# Altium project ESP32_Baseline_MCU.PrjPcb
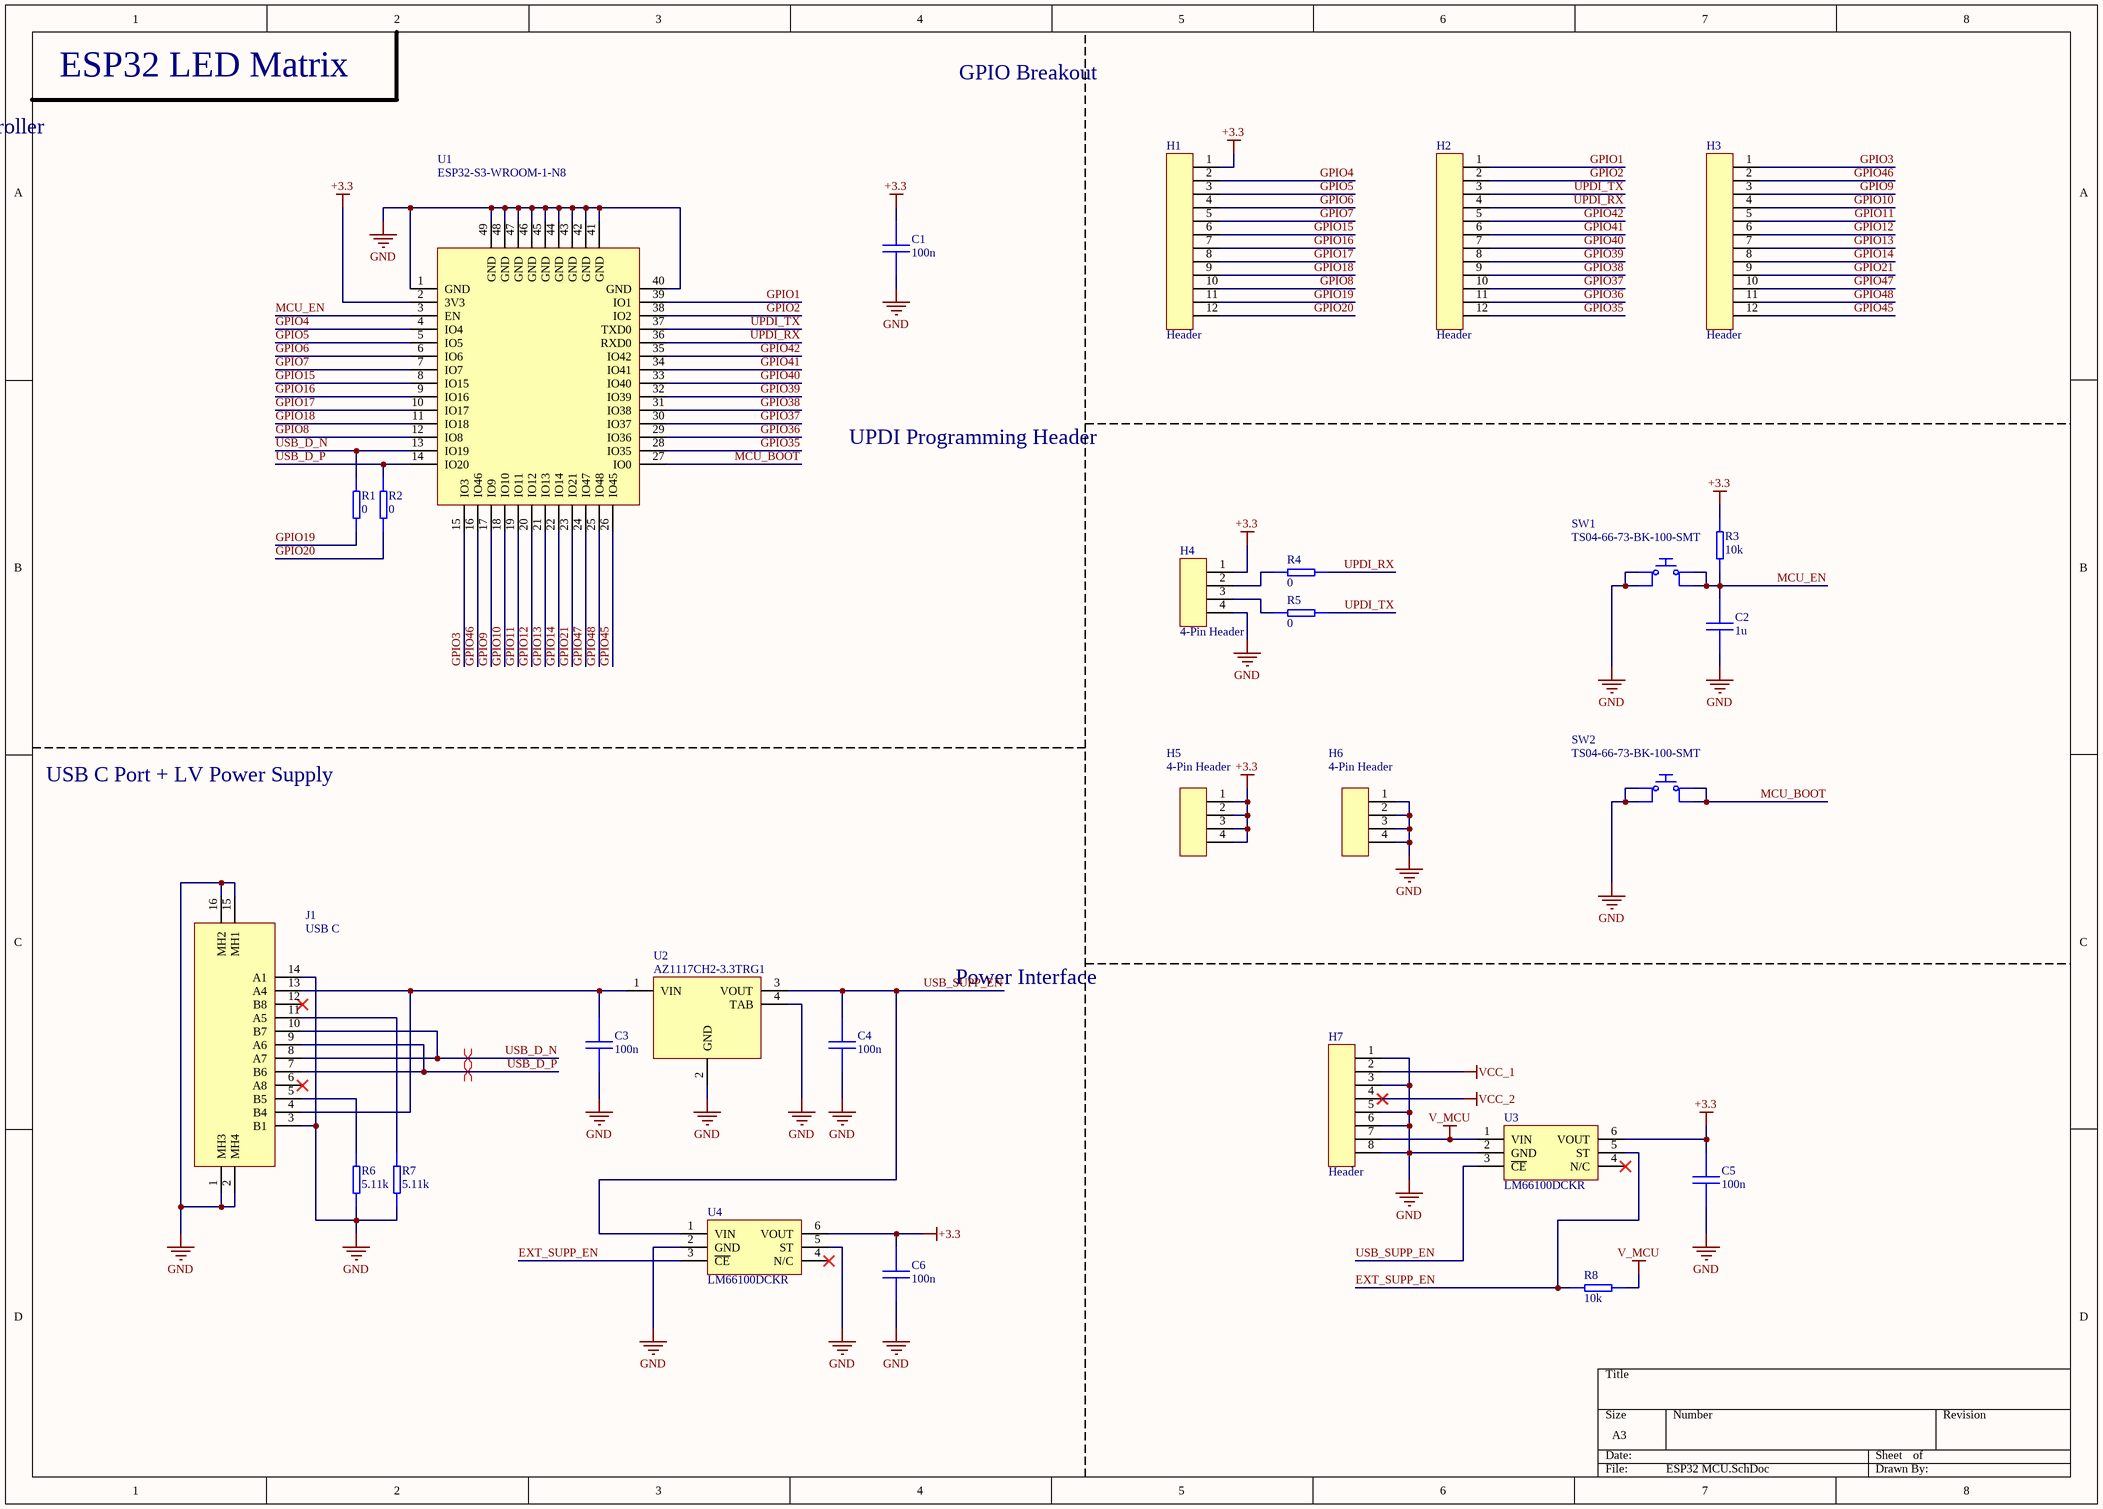
[diagram p0: ESP32 MCU.SchDoc]
1 sheet, 28 parts. Net scope: global (net labels, ports and power ports of the same name join across sheets).
Board file: ESP32_Baseline_MCU.PcbDoc

## Sheet ESP32 MCU.SchDoc
size A3; SheetNumber: 1; SheetTotal: 1

### Parts
C1  100n  [CAP0805]
C2  1u  [CAP0805]
C3  100n  [CAP0805]
C4  100n  [CAP0805]
C5  100n  [CAP0805]
C6  100n  [CAP0805]
H1  Header  [Header_1X12]
H2  Header  [Header_1X12]
H3  Header  [Header_1X12]
H4  4-Pin Header  [Header_1X4]
H5  4-Pin Header  [Header_1X4]
H6  4-Pin Header  [Header_1X4]
H7  Header  [Header_1X8]
J1  USB C  [USB TYPE C 12 PIN]
R1  0  [RESC0805]
R2  0  [RESC0805]
R3  10k  [RESC0805]
R4  0  [RESC0805]
R5  0  [RESC0805]
R6  5.11k  [RESC0805]
R7  5.11k  [RESC0805]
R8  10k  [RESC0805]
SW1  TS04-66-73-BK-100-SMT  [Tactile Button 6.0mm x 6.0mm]
SW2  TS04-66-73-BK-100-SMT  [Tactile Button 6.0mm x 6.0mm]
U1  ESP32-S3-WROOM-1-N8  [ESP32-S3-WROOM-1-N8]
U2  AZ1117CH2-3.3TRG1  [SOT223]
U3  LM66100DCKR  [SC70-6]
U4  LM66100DCKR  [SC70-6]

### Nets
+3.3: C1.1 C5.1 C6.1 H1.1 H4.1 H5.1 H5.2 H5.3 H5.4 R3.1 U1.2(3V3) U3.6(VOUT) U4.6(VOUT)
GND: C1.2 C2.2 C3.2 C4.2 C5.2 C6.2 H4.4 H6.1 H6.2 H6.3 H6.4 H7.1 H7.3 H7.5 H7.6 H7.8 J1.1(MH3) J1.2(MH4) J1.3(B1) J1.14(A1) J1.15(MH1) J1.16(MH2) R6.1 R7.1 SW1.1 SW1.2 SW2.1 SW2.2 U1.1(GND) U1.40(GND) U1.41(GND) U1.42(GND) U1.43(GND) U1.44(GND) U1.45(GND) U1.46(GND) U1.47(GND) U1.48(GND) U1.49(GND) U2.2(GND) U2.4(TAB) U3.2(GND) U4.2(GND) U4.5(ST)
V_MCU: H7.7 R8.2 U3.1(VIN)
VCC_1: H7.2
VCC_2: H7.4
EXT_SUPP_EN: R8.1 U3.5(ST) U4.3(~{CE})
GPIO1: H2.1 U1.39(IO1)
GPIO2: H2.2 U1.38(IO2)
GPIO3: H3.1 U1.15(IO3)
GPIO4: H1.2 U1.4(IO4)
GPIO5: H1.3 U1.5(IO5)
GPIO6: H1.4 U1.6(IO6)
GPIO7: H1.5 U1.7(IO7)
GPIO8: H1.10 U1.12(IO8)
GPIO9: H3.3 U1.17(IO9)
GPIO10: H3.4 U1.18(IO10)
GPIO11: H3.5 U1.19(IO11)
GPIO12: H3.6 U1.20(IO12)
GPIO13: H3.7 U1.21(IO13)
GPIO14: H3.8 U1.22(IO14)
GPIO15: H1.6 U1.8(IO15)
GPIO16: H1.7 U1.9(IO16)
GPIO17: H1.8 U1.10(IO17)
GPIO18: H1.9 U1.11(IO18)
GPIO19: H1.11 R1.1
GPIO20: H1.12 R2.1
GPIO21: H3.9 U1.23(IO21)
GPIO35: H2.12 U1.28(IO35)
GPIO36: H2.11 U1.29(IO36)
GPIO37: H2.10 U1.30(IO37)
GPIO38: H2.9 U1.31(IO38)
GPIO39: H2.8 U1.32(IO39)
GPIO40: H2.7 U1.33(IO40)
GPIO41: H2.6 U1.34(IO41)
GPIO42: H2.5 U1.35(IO42)
GPIO45: H3.12 U1.26(IO45)
GPIO46: H3.2 U1.16(IO46)
GPIO47: H3.10 U1.24(IO47)
GPIO48: H3.11 U1.25(IO48)
MCU_BOOT: SW2.3 SW2.4 U1.27(IO0)
MCU_EN: C2.1 R3.2 SW1.3 SW1.4 U1.3(EN)
UPDI_RX: H2.4 R4.1 U1.36(RXD0)
UPDI_TX: H2.3 R5.1 U1.37(TXD0)
USB_D_N: J1.8(A7) J1.10(B7) R1.2 U1.13(IO19)
USB_D_P: J1.7(B6) J1.9(A6) R2.2 U1.14(IO20)
USB_SUPP_EN: C4.1 U2.3(VOUT) U3.3(~{CE}) U4.1(VIN)
NetC3_1: C3.1 J1.4(B4) J1.13(A4) U2.1(VIN)
NetH4_2: H4.2 R4.2
NetH4_3: H4.3 R5.2
NetJ1_5: J1.5(B5) R6.2
NetJ1_11: J1.11(A5) R7.2

Not connected (* = marked no-connect by the designer): J1 6(A8)* 12(B8)*; U3 4(N/C)*; U4 4(N/C)*

### Layout directives
differential pair: USB_D_N, USB_D_P

### Notes on the sheet
- ESP32 LED Matrix
- GPIO Breakout
- Microcontroller
- UPDI Programming Header
- USB C Port + LV Power Supply
- Power Interface

### Library data of the parts
C1-C6 = Capacitor - Non Polarized: Non Polarized Capacitor
H1-H3 = 12-Pin Header
H7 = 8-Pin Header: System: Connector
J1 = USB Type C Connector 12 Pin
R1-R8 = Resistor
SW1 SW2 = TS04-66-73-BK-100-SMT: Switch; Manufacturer_Name: Same Sky; Datasheet Link: https://www.sameskydevices.com/product/resource/supplyframepdf/ts04.pdf; Height: 7.6mm; Manufacturer_Part_Number: TS04-66-73-BK-100-SMT; Mouser Part Number: 179-TS046673BK100SMT; Mouser Price/Stock: https://www.mouser.co.uk/ProductDetail/Same-Sky/TS04-66-73-BK-100-SMT?qs=A6eO%252BMLsxmRAmp3wqRUzZw%3D%3D; Arrow Part Number: TS04-66-73-BK-100-SMT; Arrow Price/Stock: https://www.arrow.com/en/products/ts04-66-73-bk-100-smt/cui-devices?utm_currency=USD&region=nac
U1 = ESP32-S3-WROOM-1-N8: ESP32 Microcontroller with Bluetooth and Wifi
U2 = AZ1117CH2-3.3TRG1_1: 3.3V Linear Voltage Regulator
U3 U4 = LM66100DCKR: 5.5-V, 1.5-A 79-mΩ, Low IQ Ideal Diode With Input Polarity Protection; Manufacturer_Name: Texas Instruments; Datasheet Link: http://www.ti.com/lit/gpn/LM66100; Height: 1.1mm; Manufacturer_Part_Number: LM66100DCKR; Mouser Part Number: 595-LM66100DCKR; Mouser Price/Stock: https://www.mouser.co.uk/ProductDetail/Texas-Instruments/LM66100DCKR?qs=vLWxofP3U2y2yPPrXoBBoA%3D%3D; Arrow Part Number: LM66100DCKR; Arrow Price/Stock: https://www.arrow.com/en/products/lm66100dckr/texas-instruments?region=nac